# EasyEDA Pro project ProDoc_面部追踪摄像头主控板.epro, schematic Schematic2
Board Name: 面部捕捉主控板1.0; Create Date: 2026-01-11; Page Name: P1; Project Name: FAICAL TRACKER VR模块; Schematic Name: Schematic1_3; Update Date: 2026-02-02; BladeWidth: 10; Company: 嘉立创EDA; Page Size: A4; RegionStart: 1; ShowBorder: 1; TitleBlock: 1; TitleBlockPosition: 3; Version: V1.0; XRegionCount: 6; YRegionCount: 4
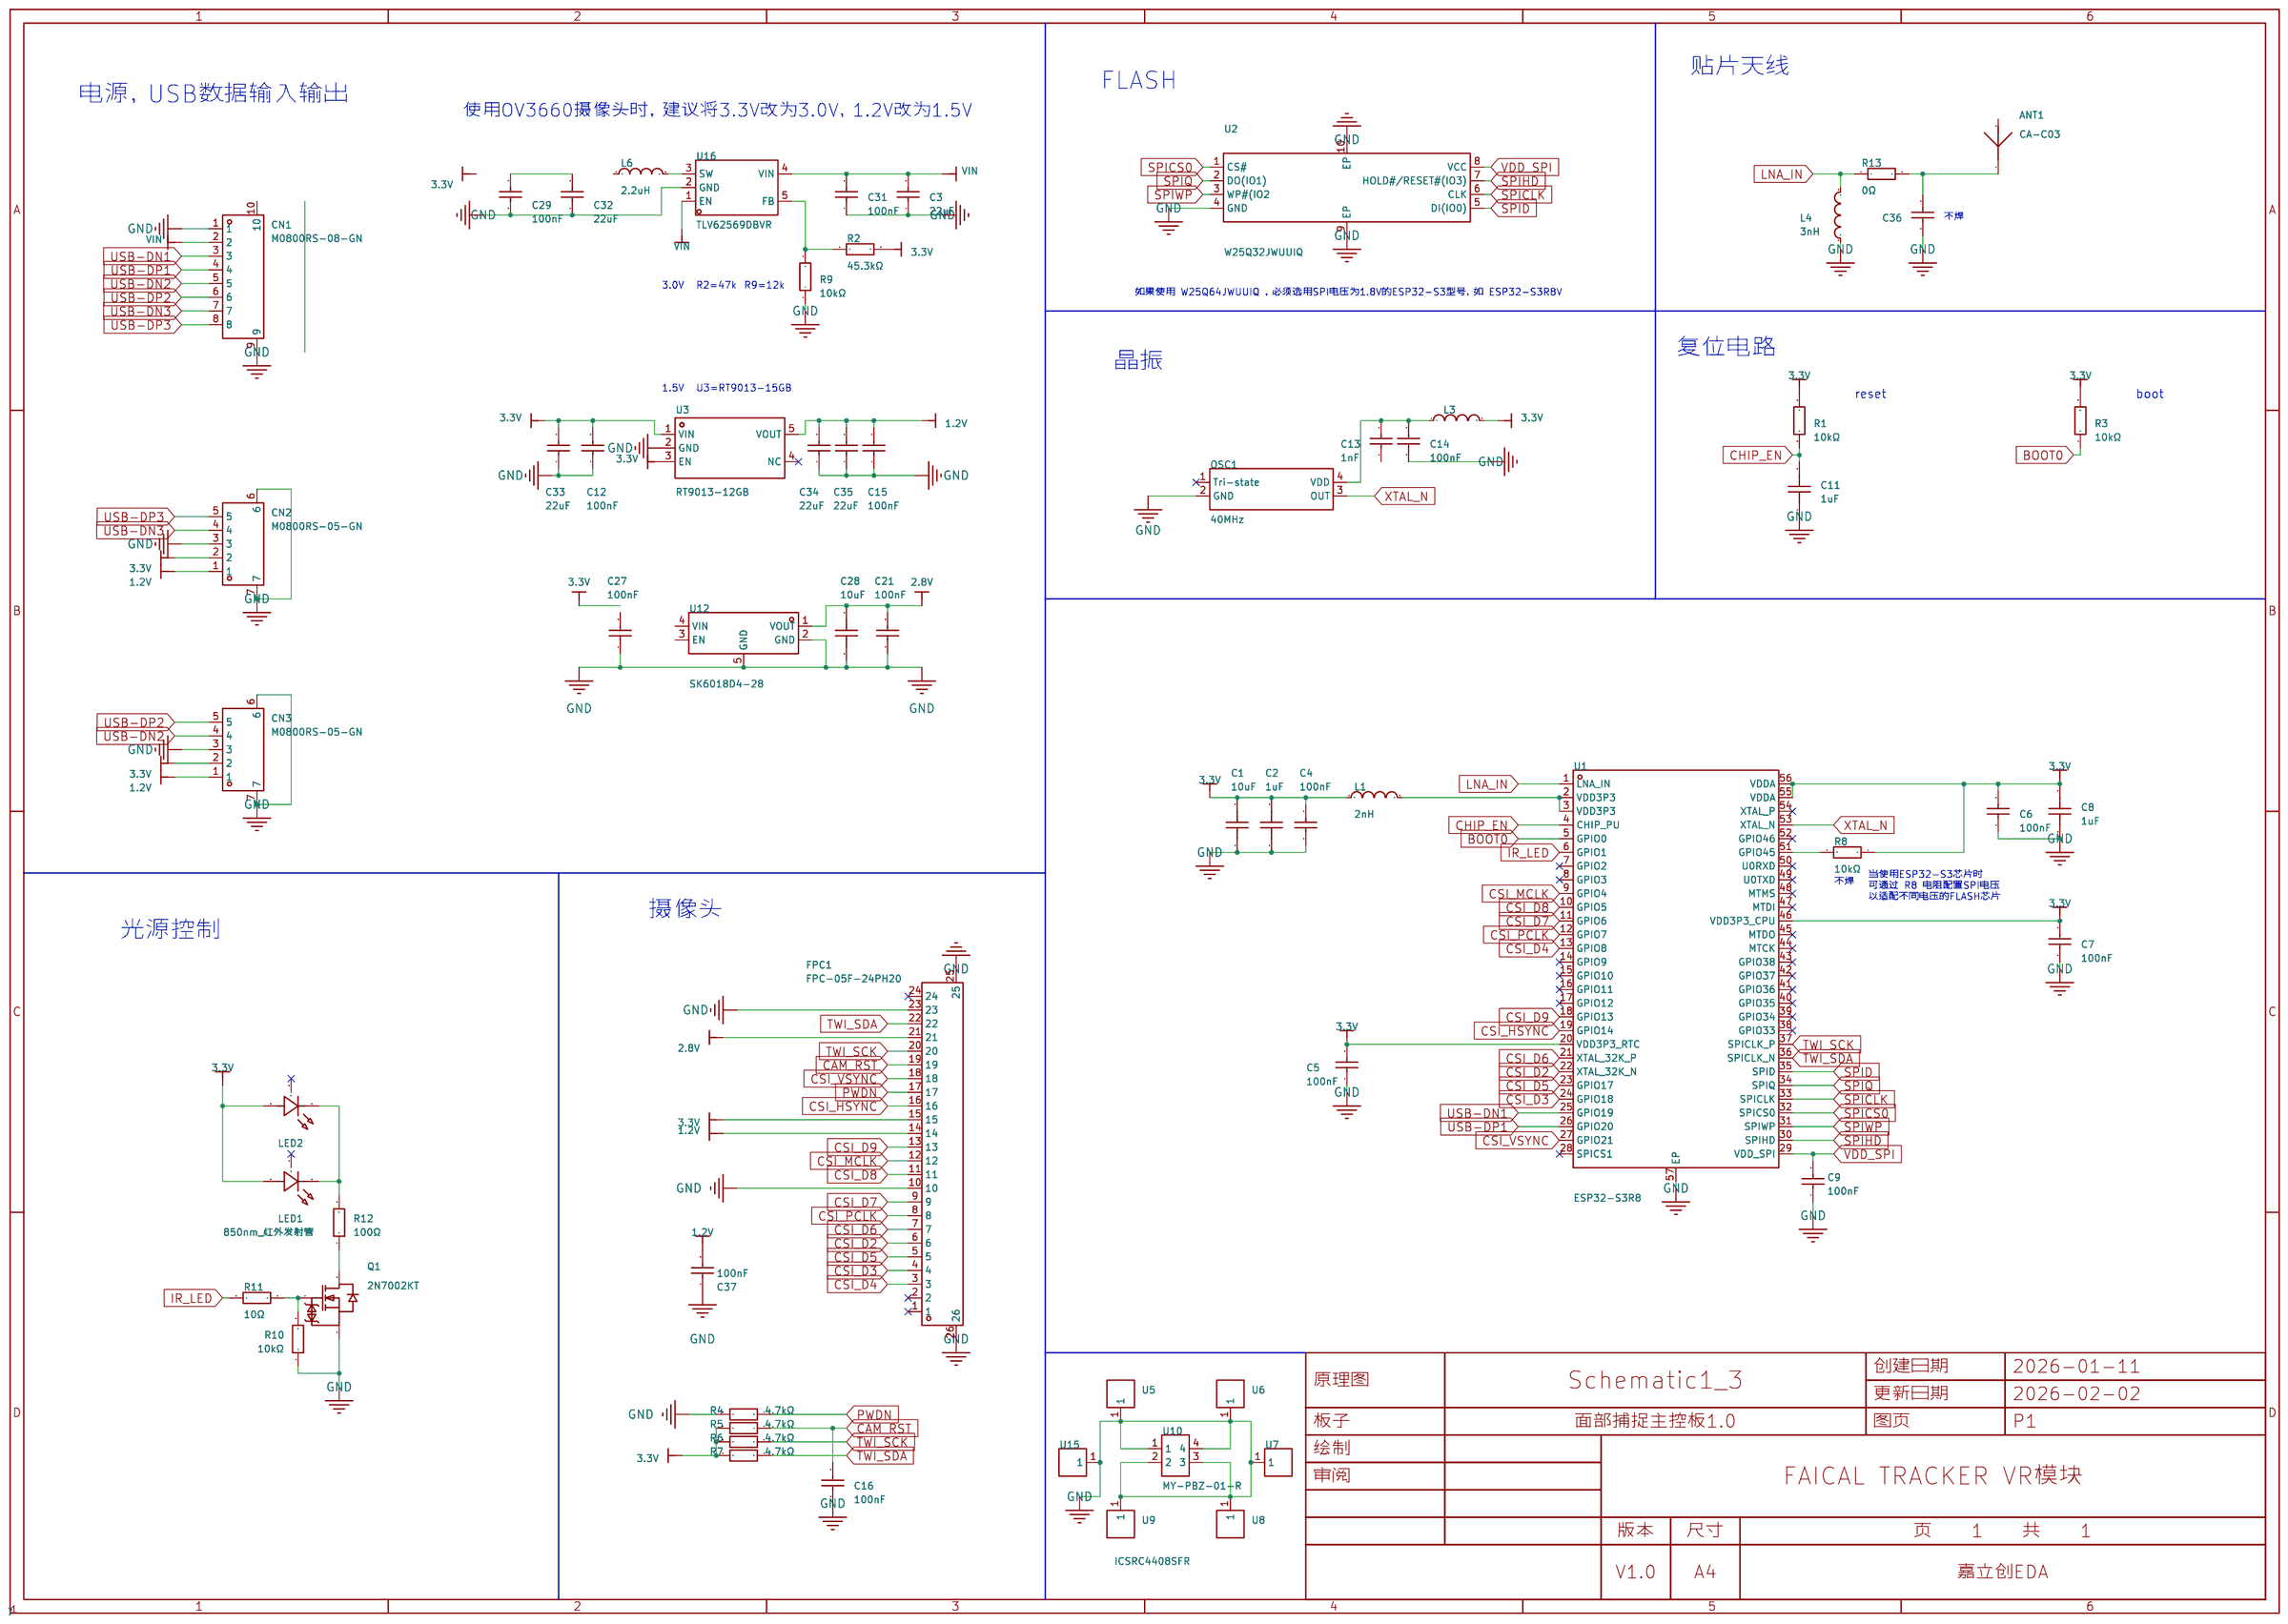
[diagram p0: schematic sheet]

## Parts
ANT1  CA-C03  [ANT-SMD_CA-C03]
C1  10uF  [0402]
C2  1uF  [0402]
C3  22uF  [0603]
C4  100nF  [0402]
C5  100nF  [0402]
C6  100nF  [0402]
C7  100nF  [0402]
C8  1uF  [0402]
C9  100nF  [0402]
C11  1uF  [0402]
C12  100nF  [0402]
C13  1nF  [0402]
C14  100nF  [0402]
C15  100nF  [0402]
C16  100nF  [0402]
C21  100nF  [0402]
C27  100nF  [0402]
C28  10uF  [0402]
C29  100nF  [0402]
C31  100nF  [0402]
C32  22uF  [0603]
C33  22uF  [0603]
C34  22uF  [0603]
C35  22uF  [0603]
C36  1pF  [0402]
C37  100nF  [0402]
CN1  M0800RS-08-GN  [CONN-SMD_M0800RS-08-GN]
CN2  M0800RS-05-GN  [CONN-SMD_M0800RS-05-GN]
CN3  M0800RS-05-GN  [CONN-SMD_M0800RS-05-GN]
FPC1  FPC-05F-24PH20  [FPC-SMD_24P-P0.50_FPC-05F-24PH20]
L1  2nH  [0402]
L3  BLM15PD121SN1D  [0402]
L4  3nH  [0402]
L6  2.2uH  [IND-SMD_L2.5-W2.0_MHCHL2520]
LED1  850nm_红外发射管  [LED-SMD_3P-L3.2-W1.5-IR]
LED2  850nm_红外发射管  [LED-SMD_3P-L3.2-W1.5-IR]
OSC1  40MHz  [OSC-SMD_4P-L2.0-W1.6-BL_S1D25.000000E10F30T]
Q1  2N7002KT  [SOT-523_L1.6-W0.8-P0.95-LS1.6-BR]
R1  10kΩ  [0402]
R2  45.3kΩ  [0402]
R3  10kΩ  [0402]
R4  4.7kΩ  [0402]
R5  4.7kΩ  [0402]
R6  4.7kΩ  [0402]
R7  4.7kΩ  [0402]
R8  10kΩ  [0402]
R9  10kΩ  [0402]
R10  10kΩ  [0402]
R11  10Ω  [0402]
R12  100Ω  [0603]
R13  0Ω  [0402]
U1  ESP32-S3R8  [QFN-56_L7.0-W7.0-P0.40-TL-EP4.0]
U2  W25Q32JWUUIQ  [USON-8_L4.0-W3.0-P0.80-BL_WINBOND_UU]
U3  RT9013-12GB  [SOT-23-5_L3.0-W1.7-P0.95-LS2.8-BR]
U5  ICSRC4408SFR  [屏蔽夹 4.4*0.8]
U6  ICSRC4408SFR  [屏蔽夹 4.4*0.8]
U7  ICSRC4408SFR  [屏蔽夹 4.4*0.8]
U8  ICSRC4408SFR  [屏蔽夹 4.4*0.8]
U9  ICSRC4408SFR  [屏蔽夹 4.4*0.8]
U10  MY-PBZ-01-R  [CONN-SMD_MY-PBZ-01-R]
U12  SK6018D4-28  [XDFN-4_L1.0-W1.0-P0.65-BL-EP]
U15  ICSRC4408SFR  [屏蔽夹 4.4*0.8]
U16  TLV62569DBVR  [SOT-23-5_L3.0-W1.7-P0.95-LS2.8-BR]

## Library data of the parts
ANT1 = CA-C03: Supplier Part: C2838842; Supplier Footprint: 5520; JLCPCB Part Class: 扩展库; Datasheet: 2021-06-05/34112A/eaa7f794ae26492fadde70fdd3fe967f/CA-C03应用手册.pdf; Supplier: LCSC
C1 C28 = CL05A106MP5NUNC: 容值:10uF;精度:±20%;额定电压:10V;材质(温度系数):X5R;; LCSC Part Name: 10uF ±20% 10V; Supplier Part: C315248; Manufacturer: SAMSUNG(三星); JLCPCB Part Class: Extended Part; Datasheet: https://atta.szlcsc.com/upload/public/pdf/source/20231220/1EF805BAE1520675928CC4638D279E74.pdf; Supplier: LCSC; Tolerance: ±20%; Voltage Rated: 10V; Temperature Coefficient: X5R
C2 C8 C11 = CL05A105KA5NQNC: 容值:1uF;精度:±10%;额定电压:25V;材质(温度系数):X5R;; LCSC Part Name: 1uF ±10% 25V; Supplier Part: C52923; Manufacturer: SAMSUNG(三星); JLCPCB Part Class: 基础库; Datasheet: https://atta.szlcsc.com/upload/public/pdf/source/20160218/1457707763339.pdf; Supplier: LCSC; Tolerance: ±10%; Voltage Rated: 25V; Temperature Coefficient: X5R
C3 C32-C35 = CL10A226MQ8NRNC: 容值:22uF;精度:±20%;额定电压:6.3V;温度系数:X5R;; LCSC Part Name: 22uF ±20% 6.3V; Supplier Part: C59461; Manufacturer: SAMSUNG(三星); JLCPCB Part Class: Basic Part; Datasheet: https://item.szlcsc.com/datasheet/CL10A226MQ8NRNC/60514.html; Supplier: LCSC; Tolerance: ±20%; Voltage Rated: 6.3V; Temperature Coefficient: X5R; Voltage Rating: 6.3V
C4-C7 C9 C16 C21 C27 = 0402B104K500NT: 容值:100nF;精度:±10%;额定电压:50V;温度系数:X7R;; LCSC Part Name: 100nF ±10% 50V; Supplier Part: C110251; Manufacturer: FH(风华); JLCPCB Part Class: 扩展库; Datasheet: https://atta.szlcsc.com/upload/public/pdf/source/20200305/C486355_26A10D38EF8C2A5C37091D0039909270.pdf; Supplier: LCSC; Tolerance: ±10%; Voltage Rating: 50V; Temperature Coefficient: X7R
C12 C14 C15 C29 C31 C37 = 0402B104K500NT: 容值:100nF;精度:±10%;额定电压:50V;温度系数:X7R;; LCSC Part Name: 100nF ±10% 50V; Supplier Part: C110251; Manufacturer: FH(风华); JLCPCB Part Class: Extended Part; Datasheet: https://atta.szlcsc.com/upload/public/pdf/source/20200305/C486355_26A10D38EF8C2A5C37091D0039909270.pdf; Supplier: LCSC; Tolerance: ±10%; Voltage Rating: 50V; Temperature Coefficient: X7R
C13 = 0402B102K500NT: 容值:1nF;精度:±10%;额定电压:50V;材质(温度系数):X7R;; LCSC Part Name: 1nF ±10% 50V; Supplier Part: C1523; Manufacturer: FH(风华); JLCPCB Part Class: Basic Part; Datasheet: https://atta.szlcsc.com/upload/public/pdf/source/20200305/C486355_26A10D38EF8C2A5C37091D0039909270.pdf; Supplier: LCSC; Tolerance: ±10%; Voltage Rated: 50V; Temperature Coefficient: X7R
C36 = GJM1555C1H1R0BB01D: 容值:1pF;额定电压:50V;温度系数:C0G;; LCSC Part Name: ±0.1pF 1pF 50V; Supplier Part: C76898; Manufacturer: muRata(村田); JLCPCB Part Class: 扩展库; Datasheet: https://item.szlcsc.com/datasheet/GJM1555C1H1R0BB01D/78025.html; Supplier: LCSC; Voltage Rating: 50V; Temperature Coefficient: C0G
CN1 = M0800RS-08-GN: 插针结构:1x8P;间距:0.8mm;安装方式:卧贴;参考系列:-;总PIN数:8P;排数:1;每排PIN数:8;行距:-;额定电流:-;工作温度范围:-;; LCSC Part Name: 1x8P 间距:0.8mm 卧贴; Supplier Part: C509170; Manufacturer: XFCN(兴飞); Supplier Footprint: SMD,P=0.8mm,卧贴; JLCPCB Part Class: Extended Part; Datasheet: https://atta.szlcsc.com/upload/public/pdf/source/20200407/C509164_BF52F945AC88792F216409D296077FAE.pdf; Supplier: LCSC; Pins Structure: 1x8P; Pitch: 0.8mm; Mounting Style: 卧贴; Number of Pins: 8P; Number of Rows: 1; Number of PINs Per Row: 8
CN2 CN3 = M0800RS-05-GN: 插针结构:1x5P;间距:0.8mm;安装方式:卧贴;参考系列:-;总PIN数:5P;排数:1;每排PIN数:5;行距:-;额定电流:-;触头材质:磷青铜;工作温度:-;; LCSC Part Name: 1x5P 间距:0.8mm 卧贴; Supplier Part: C509167; Manufacturer: XFCN(兴飞); Supplier Footprint: SMD,P=0.8mm,卧贴; JLCPCB Part Class: Extended Part; Datasheet: https://item.szlcsc.com/datasheet/M0800RS-05-GN/522976.html; Supplier: LCSC; Pins Structure: 1x5P; Pitch: 0.8mm; Mounting Type: 卧贴; Number of Pins: 5P; Number of Rows: 1; Number of PINs Per Row: 5; Contact Material: 磷青铜; Flame Retardant Rating: UL94V-0; Z-Height of the Board: 1.7mm; Y-Width of Bottom Edge on Board: 2.7mm
FPC1 = FPC-05F-24PH20: 锁定特性:翻盖式;触点类型:下接;触点数量:24P;间距:0.5mm;安装类型:卧贴;工作温度范围:-25℃~+85℃;; LCSC Part Name: 间距:0.5mm P数:24P 翻盖式 下接; Supplier Part: C2856805; Manufacturer: XUNPU(讯普); Supplier Footprint: SMD,P=0.5mm,卧贴; JLCPCB Part Class: 扩展库; Datasheet: https://atta.szlcsc.com/upload/public/pdf/source/20210922/C2856805_8542C20E2D7FF0FC4EEBD919AE0F6905.pdf; Supplier: LCSC; Locking Feature: 翻盖式; Contact Type: 下接; Number of Contacts: 24P; Pitch: 0.5mm; Mounting Type: 卧贴; FFC, FCB Thickness: 0.3mm; Height Above Board: 2mm; Operating Temperature Range: -25℃~+85℃
L1 = MLG1005S2N0BT000: 电感值:2nH;精度:-;额定电流:900mA;饱和电流(Isat):-;直流电阻(DCR):70mΩ;; LCSC Part Name: ±0.1nH 2nH; Supplier Part: C76769; Manufacturer: TDK; JLCPCB Part Class: Extended Part; Datasheet: https://atta.szlcsc.com/upload/public/pdf/source/20240116/5498F69597B6145D9954BDAE22913204.pdf; Supplier: LCSC; Current Rating: 900mA; DC Resistance(DCR): 70mΩ; Q @ Frequency: 7@100MHz; Frequency - Self Resonant: 7.5GHz
L3 = BLM15PD121SN1D: 标称阻抗@测试频率:120Ω@100MHz;误差:±25%;直流电阻(RDC):90mΩ;; LCSC Part Name: 单路 0402磁珠 阻抗120Ω@100MHz; Supplier Part: C76891; Manufacturer: muRata(村田); JLCPCB Part Class: 扩展库; Datasheet: https://atta.szlcsc.com/upload/public/pdf/source/20181120/C333978_3E581FB55966932B05020139ABDE8E01.pdf; Supplier: LCSC; Impedance @ Frequency: 120Ω@100MHz; Tolerance: ±25%; DC Resistance: 90mΩ; Current Rating: 1.3A; Circuits: 1
L4 = VHF100505HQ3N0ST: 电感值:3nH;额定电流:300mA;饱和电流(Isat):-;直流电阻(DCR):200mΩ;; LCSC Part Name: 3nH ±0.3nH; Supplier Part: C395064; Manufacturer: FH(风华); JLCPCB Part Class: Extended Part; Datasheet: https://atta.szlcsc.com/upload/public/pdf/source/20230208/097A5FD33363C9318A1C8B9447979AC6.pdf; Supplier: LCSC; Rated Current: 300mA; DC Resistance (DCR): 200mΩ
L6 = FTC252012S2R2MBCA: 电感值:2.2uH;精度:±20%;额定电流:3A;饱和电流(Isat):3.8A;类型:一体成型电感;; LCSC Part Name: 2.2uH ±20% 3.8A; Supplier Part: C5832372; Manufacturer: cjiang(长江微电); Supplier Footprint: 1008; JLCPCB Part Class: Extended Part; Datasheet: https://atta.szlcsc.com/upload/public/pdf/source/20230602/8FFEDA9C0247A92A0D4B67554BFE4091.pdf; Supplier: LCSC; Tolerance: ±20%; Rated Current: 3A; Saturation Current (Isat): 3.8A; DC Resistance (DCR): 55mΩ; Type: 一体成型电感
LED1 LED2 = 1206/1204_红外850nm: 1206/1204_红外850nm，侧面发光,红外发射管; LCSC Part Name: 贴片式发光二极管; Supplier Part: C965877; Manufacturer: XINGLIGHT(成兴光); Supplier Footprint: SMD-3P,3.2x1.5mm; JLCPCB Part Class: Extended Part; Datasheet: https://item.szlcsc.com/datasheet/XL-3210UGC/1051486.html; Supplier: LCSC; Illumination Color: 翠绿色; Wavelength - Dominant: 517.5nm~525nm; Peak Wavelength: 535nm; Lens Color: 无色透明透镜; Viewing Angle: 120°; Mounting Style: 侧贴
OSC1 = OT7EL89CJI-111YLC-40M: 频率:40MHz;常温频差:±10ppm;输出模式:CMOS;工作电压:1.8V~3.3V;频率稳定度:±20ppm;; LCSC Part Name: YSO110TR 40MHZ 4P 2016 1.8V-3.3V ±10PPM -40~85℃ (±20PPM) CMOS; Supplier Part: C7434947; Manufacturer: YXC(扬兴晶振); Supplier Footprint: SMD2016-4P; JLCPCB Part Class: Extended Part; Datasheet: https://atta.szlcsc.com/upload/public/pdf/source/20240731/596E5F7673E50DA744B7F79F139FB8DF.pdf; Supplier: LCSC; Normal temperature Frequency Tolerance: ±10ppm; Output Type: CMOS; Voltage - Supply: 1.8V~3.3V; Frequency Stability: ±20ppm; Operating Temperature: -40℃~+85℃
Q1 = 2N7002KT_C45406498: 漏源电压(Vdss):60V;连续漏极电流(Id):340mA;导通电阻(RDS(on)):3.2Ω@4.5V;耗散功率(Pd):150mW;阈值电压(Vgs(th)):2.5V@1mA;; LCSC Part Name: 60V N通道增强模式MOSFET; Supplier Part: C45406498; Manufacturer: MDD(辰达半导体); Supplier Footprint: SOT-523; JLCPCB Part Class: 扩展库; Datasheet: https://item.szlcsc.com/datasheet/2N7002KT/47507896.html; Supplier: LCSC; Drain to Source Voltage: 60V; Current - Continuous Drain(Id): 340mA; RDS(on): 3.2Ω@4.5V; Pd - Power Dissipation: 150mW; Gate Threshold Voltage (Vgs(th)): 2.5V@1mA; Input Capacitance(Ciss): 40pF; Reverse Transfer Capacitance (Crss@Vds): 10pF; Type: N沟道; Output Capacitance(Coss): 30pF
R1 R3 R8 R10 = 0402WGF1002TCE: 电阻类型:厚膜电阻;阻值:10kΩ;精度:±1%;功率:62.5mW;最大工作电压:50V;温度系数:±100ppm/℃;; LCSC Part Name: 10kΩ ±1% 62.5mW 厚膜电阻; Supplier Part: C25744; Manufacturer: UNI-ROYAL(厚声); JLCPCB Part Class: 基础库; Datasheet: https://atta.szlcsc.com/upload/public/pdf/source/20200306/C422600_1E6D84923E4A46A82E41ADD87F860B5C.pdf; Supplier: LCSC; Type: 厚膜电阻; Tolerance: ±1%; Power(Watts): 62.5mW; Overload Voltage (Max): 50V; Temperature Coefficient: ±100ppm/℃; Operating Temperature Range: -55℃~+155℃
R2 = 0402WGF4532TCE: 电阻类型:厚膜电阻;阻值:45.3kΩ;精度:±1%;功率:62.5mW;工作电压:50V;温度系数:±100ppm/℃;; LCSC Part Name: 45.3kΩ ±1% 62.5mW 厚膜电阻; Supplier Part: C26980; Manufacturer: UNI-ROYAL(厚声); JLCPCB Part Class: Extended Part; Datasheet: https://item.szlcsc.com/datasheet/0402WGF4532TCE/27729.html; Supplier: LCSC; Type: 厚膜电阻; Tolerance: ±1%; Power(Watts): 62.5mW; Overload Voltage (Max): 50V; Temperature Coefficient: ±100ppm/℃; Operating Temperature Range: -55℃~+155℃; Voltage-Supply(Max): 50V; Operating Temperature: -55℃~+155℃
R4-R7 = 0402WGF4701TCE: 电阻类型:厚膜电阻;阻值:4.7kΩ;精度:±1%;功率:62.5mW;工作电压:50V;温度系数:±100ppm/℃;; LCSC Part Name: 4.7kΩ ±1% 62.5mW 厚膜电阻; Supplier Part: C25900; Manufacturer: UNI-ROYAL(厚声); JLCPCB Part Class: Basic Part; Datasheet: https://item.szlcsc.com/datasheet/0402WGF4701TCE/26643.html; Supplier: LCSC; Type: 厚膜电阻; Tolerance: ±1%; Power(Watts): 62.5mW; Overload Voltage (Max): 50V; Temperature Coefficient: ±100ppm/℃; Operating Temperature Range: -55℃~+155℃; Voltage-Supply(Max): 50V; Operating Temperature: -55℃~+155℃
R9 = 0402WGF1002TCE: 电阻类型:厚膜电阻;阻值:10kΩ;精度:±1%;功率:62.5mW;工作电压:50V;温度系数:±100ppm/℃;; LCSC Part Name: 10kΩ ±1% 62.5mW 厚膜电阻; Supplier Part: C25744; Manufacturer: UNI-ROYAL(厚声); JLCPCB Part Class: Basic Part; Datasheet: https://item.szlcsc.com/datasheet/0402WGF1002TCE/26487.html; Supplier: LCSC; Type: 厚膜电阻; Tolerance: ±1%; Power(Watts): 62.5mW; Overload Voltage (Max): 50V; Temperature Coefficient: ±100ppm/℃; Operating Temperature Range: -55℃~+155℃; Voltage-Supply(Max): 50V; Operating Temperature: -55℃~+155℃
R11 = 0402WGF100JTCE: 电阻类型:厚膜电阻;阻值:10Ω;精度:±1%;功率:62.5mW;工作电压:50V;温度系数:±200ppm/℃;; LCSC Part Name: 10Ω ±1% 62.5mW 厚膜电阻; Supplier Part: C25077; Manufacturer: UNI-ROYAL(厚声); JLCPCB Part Class: Basic Part; Datasheet: https://item.szlcsc.com/datasheet/0402WGF100JTCE/25820.html; Supplier: LCSC; Type: 厚膜电阻; Tolerance: ±1%; Power(Watts): 62.5mW; Overload Voltage (Max): 50V; Temperature Coefficient: ±200ppm/℃; Operating Temperature Range: -55℃~+155℃; Voltage-Supply(Max): 50V; Operating Temperature: -55℃~+155℃
R12 = 0603WAF1000T5E: 电阻类型:厚膜电阻;阻值:100Ω;精度:±1%;功率:100mW;最大工作电压:75V;温度系数:±200ppm/℃;; LCSC Part Name: 100Ω ±1% 100mW 厚膜电阻; Supplier Part: C22775; Manufacturer: UNI-ROYAL(厚声); JLCPCB Part Class: 基础库; Datasheet: https://atta.szlcsc.com/upload/public/pdf/source/20200306/C422600_1E6D84923E4A46A82E41ADD87F860B5C.pdf; Supplier: LCSC; Type: 厚膜电阻; Tolerance: ±1%; Power(Watts): 100mW; Overload Voltage (Max): 75V; Temperature Coefficient: ±200ppm/℃; Operating Temperature Range: -55℃~+155℃
R13 = 0402WGF0000TCE: 电阻类型:厚膜电阻;阻值:0Ω;精度:±1%;功率:62.5mW;工作电压:50V;温度系数:±800ppm/℃;; LCSC Part Name: 0Ω ±1% 62.5mW 厚膜电阻; Supplier Part: C17168; Manufacturer: UNI-ROYAL(厚声); JLCPCB Part Class: Basic Part; Datasheet: https://item.szlcsc.com/datasheet/0402WGF0000TCE/17853.html; Supplier: LCSC; Type: 厚膜电阻; Tolerance: ±1%; Power(Watts): 62.5mW; Voltage-Supply(Max): 50V; Temperature Coefficient: ±800ppm/℃; Operating Temperature: -55℃~+155℃
U1 = ESP32-S3R8: 频率范围:2.412GHz~2.484GHz;接口类型:I2C；I2S；UART；USB；SPI;应用领域:蓝牙；IoT；WiFi;数据速率:150Mbps;灵敏度:-74.2dBm;典型应用频率:2.4GHz;; Supplier Part: C2913194; Manufacturer: ESPRESSIF(乐鑫); Supplier Footprint: QFN-56(7x7); JLCPCB Part Class: Extended Part; Datasheet: https://item.szlcsc.com/datasheet/ESP32-S3R8/3198292.html; Supplier: LCSC; Frequency Range: 2.412GHz~2.484GHz; Interface: I2C；I2S；UART；USB；SPI; Voltage - Supply: 3V~3.6V; Applications: 蓝牙；IoT；WiFi; Output Power: 18.5dBm; Data Rate: 150Mbps; Current Of Transmitting: 283mA; Sensitivity: -74.2dBm; Receive Current: 88mA; Typical Application Frequency: 2.4GHz; Operating Temperature: -40℃~+65℃
U2 = W25Q32JWUUIQ: 接口类型:SPI;存储容量:32Mbit;时钟频率(fc):133MHz;; LCSC Part Name: 支持双路、四路SPI接口的1.8V、32Mbit 串行闪存; Supplier Part: C2760370; Manufacturer: Winbond(华邦); Supplier Footprint: USON-8(3x4); JLCPCB Part Class: Extended Part; Datasheet: https://item.szlcsc.com/datasheet/W25Q32JWUUIQ/2881016.html; Supplier: LCSC; Interface: SPI; Memory Size: 32Mbit; Clock Frequency: 133MHz; Voltage - Supply: 1.7V~1.95V; Program / Erase Cycles: 100000次; Page Programming Time (Tpp): 800us; Block Erase Time(tBE): 120ms@(32KB); Data Retention - TDR (Year): 20年
U3 = RT9013-12GB: 输出类型:固定;最大输入电压:5.5V;输出电压:1.2V;最大输出电流:500mA;电源纹波抑制比(PSRR):50dB@(10kHz);输出极性:正极;; LCSC Part Name: 输入5.5V 输出1.2V~1.2V 500mA; Supplier Part: C58464; Manufacturer: RICHTEK(立锜); Supplier Footprint: SOT-23-5; JLCPCB Part Class: 扩展库; Datasheet: https://atta.szlcsc.com/upload/public/pdf/source/20151126/1457707591671.pdf; Supplier: LCSC; Output Type: 固定; Maximum Input Voltage: 5.5V; Output Voltage: 1.2V; MAX Output Current: 500mA; Power Supply Rejection Ratio (PSRR): 50dB@(10kHz); Dropout Voltage: 400mV@(500mA); standby current: 50uA; Operating Temperature: -40℃~+85℃; Output Polarity: 正极; Number of Outputs: 1
U5-U9 U15 = ICSRC4408SFR: LCSC Part Name: ICT，屏蔽夹 ，长4.4mm*高0.8mm，ICSRC4408SFR; Supplier Part: C238201; Manufacturer: ICT; JLCPCB Part Class: Extended Part; Datasheet: https://item.szlcsc.com/datasheet/ICSRC4408SFR/237762.html; Supplier: LCSC; size: 4.4mm*0.8mm; colour: 白色
U10 = MY-PBZ-01-R: 屏蔽罩PBZ屏蔽框/屏蔽架/屏蔽盖/阻止产品内部电路和生产的电磁波向外辐射，防尘，材质：洋白铜; LCSC Part Name: 屏蔽罩; Supplier Part: C964879; Manufacturer: MYOUNG(美阳); Supplier Footprint: DIP; JLCPCB Part Class: 扩展库; Datasheet: https://item.szlcsc.com/datasheet/MY-PBZ-01-R/1049845.html; Supplier: LCSC; material quality: 洋白铜; characteristic: 阻止产品内部电路和生产的电磁波向外辐射,防尘; size: 13.84*10.47mm
U12 = SK6018D4-28: 输出类型:固定;工作电压:6.5V;输出电压:2.8V;输出电流:300mA;电源纹波抑制比(PSRR):-;输出极性:正极;; LCSC Part Name: 低压差线性稳压器; Supplier Part: C2682757; Manufacturer: suntek(洺太电子); Supplier Footprint: XDFN-4-EP(1x1); JLCPCB Part Class: Extended Part; Datasheet: https://item.szlcsc.com/datasheet/SK6018D4-28/2777833.html; Supplier: LCSC; Output Type: 固定; Voltage - Supply: 6.5V; Output Voltage: 2.8V; Output Current: 300mA; standby current: 1uA; Features: 带使能; Operating Temperature: -40℃~+85℃@(Ta); Output Configuration: 正极; Number of Outputs: 1
U16 = TLV62569DBVR: 功能类型:降压型;工作电压:2.5V~5.5V;输出电压:600mV~5.5V;输出电流:2A;输出类型:可调;; LCSC Part Name: 高效率同步降压转换器; Supplier Part: C141836; Manufacturer: TI(德州仪器); Supplier Footprint: SOT-23-5; JLCPCB Part Class: 扩展库; Datasheet: https://www.ti.com/cn/lit/gpn/tlv62569; Supplier: LCSC; Function: 降压型; Voltage - Supply: 2.5V~5.5V; Output Voltage: 600mV~5.5V; Output Current: 2A; Frequency - Switching: 1.5MHz; Operating Temperature: -40℃~+125℃@(TJ); Synchronous Rectifier: 是; Number of Outputs: 1; Topology: 降压式; Switch tube (built-in/external): 内置; Output Type: 可调

## Nets
1.2V: C15.2 C34.2 C35.2 C37.2 CN2.1 CN3.1 FPC1.15 U3.5(VOUT)
2.8V: C21.2 C28.2 FPC1.21 U12.1(VOUT)
3.3V: C1.2 C2.2 C4.2 C5.2 C6.2 C7.2 C8.2 C12.2 C27.2 C29.1 C32.1 C33.2 CN2.2 CN3.2 FPC1.14 L1.1 L3.2 L6.1 LED1.2 LED2.2 R1.2 R2.2 R3.2 R5.2 R6.2 R7.2 R8.1 U1.20(VDD3P3_RTC) U1.46(VDD3P3_CPU) U1.55(VDDA) U1.56(VDDA) U3.1(VIN) U3.3(EN) U12.3(EN) U12.4(VIN)
GND: C1.1 C2.1 C3.1 C4.1 C5.1 C6.1 C7.1 C8.1 C9.1 C11.1 C12.1 C13.1 C14.1 C15.1 C16.1 C21.1 C27.1 C28.1 C29.2 C31.1 C32.2 C33.1 C34.1 C35.1 C36.1 C37.1 CN1.1 CN1.9 CN1.10 CN2.3 CN2.6 CN2.7 CN3.3 CN3.6 CN3.7 FPC1.10 FPC1.23 FPC1.25 FPC1.26 L4.1 OSC1.2(GND) Q1.2(S) R4.2 R9.1 R10.1 U1.57(EP) U2.4(GND) U2.9(EP) U2.10(EP) U3.2(GND) U5.1 U6.1 U7.1 U8.1 U9.1 U10.1 U10.2 U10.3 U10.4 U12.2(GND) U12.5(GND) U15.1 U16.2(GND)
VDD_SPI: C9.2 U1.29(VDD_SPI) U2.8(VCC)
VIN: C3.2 C31.2 CN1.2 U16.1(EN) U16.4(VIN)
BOOT0: R3.1 U1.5(GPIO0)
CAM_RST: C16.2 FPC1.19 R5.1
CHIP_EN: C11.2 R1.1 U1.4(CHIP_PU)
CSI_D2: FPC1.6 U1.22(XTAL_32K_N)
CSI_D3: FPC1.4 U1.24(GPIO18)
CSI_D4: FPC1.3 U1.13(GPIO8)
CSI_D5: FPC1.5 U1.23(GPIO17)
CSI_D6: FPC1.7 U1.21(XTAL_32K_P)
CSI_D7: FPC1.9 U1.11(GPIO6)
CSI_D8: FPC1.11 U1.10(GPIO5)
CSI_D9: FPC1.13 U1.18(GPIO13)
CSI_HSYNC: FPC1.16 U1.19(GPIO14)
CSI_MCLK: FPC1.12 U1.9(GPIO4)
CSI_PCLK: FPC1.8 U1.12(GPIO7)
CSI_VSYNC: FPC1.18 U1.27(GPIO21)
IR_LED: R11.2 U1.6(GPIO1)
LNA_IN: L4.2 R13.1 U1.1(LNA_IN)
PWDN: FPC1.17 R4.1
SPICLK: U1.33(SPICLK) U2.6(CLK)
SPICS0: U1.32(SPICS0) U2.1(CS#)
SPID: U1.35(SPID) U2.5(DI(IO0))
SPIHD: U1.30(SPIHD) U2.7(HOLD#/RESET#(IO3))
SPIQ: U1.34(SPIQ) U2.2(DO(IO1))
SPIWP: U1.31(SPIWP) U2.3(WP#(IO2)
TWI_SCK: FPC1.20 R6.1 U1.37(SPICLK_P)
TWI_SDA: FPC1.22 R7.1 U1.36(SPICLK_N)
USB-DN1: CN1.3 U1.25(GPIO19)
USB-DN2: CN1.5 CN3.4
USB-DN3: CN1.7 CN2.4
USB-DP1: CN1.4 U1.26(GPIO20)
USB-DP2: CN1.6 CN3.5
USB-DP3: CN1.8 CN2.5
XTAL_N: OSC1.3(OUT) U1.53(XTAL_N)
$1N1778: L1.2 U1.2(VDD3P3) U1.3(VDD3P3)
$1N20382: C13.2 C14.2 L3.1 OSC1.4(VDD)
$1N20736: ANT1.1(ANT) C36.2 R13.2
$1N28125: R8.2 U1.51(GPIO45)
$1N40253: R2.1 R9.2 U16.5(FB)
$1N40257: L6.2 U16.3(SW)
$1N41252: Q1.1(G) R10.2 R11.1
$1N41612: LED1.1 LED2.1 R12.2
$1N41730: Q1.3(D) R12.1

Not connected (* = marked no-connect by the designer): ANT1 2(NC); FPC1 1* 2* 24*; LED1 3*; LED2 3*; OSC1 1(Tri-state)*; U1 7(GPIO2)* 8(GPIO3)* 14(GPIO9)* 15(GPIO10)* 16(GPIO11)* 17(GPIO12)* 28(SPICS1)* 38(GPIO33)* 39(GPIO34)* 40(GPIO35)* 41(GPIO36)* 42(GPIO37)* 43(GPIO38)* 44(MTCK)* 45(MTDO)* 47(MTDI)* 48(MTMS)* 49(U0TXD)* 50(U0RXD)* 52(GPIO46)* 54(XTAL_P)*; U3 4(NC)*

## Notes on the sheet
- 贴片天线
- FLASH
- 电源，USB数据输入输出
- 使用OV3660摄像头时，建议将3.3V改为3.0V，1.2V改为1.5V
- 不焊
- 3.0V
- R2=47k
- R9=12k
- 如果使用 W25Q64JWUUIQ ，必须选用SPI电压为1.8V的ESP32-S3型号，如 ESP32-S3R8V
- 晶振
- 复位电路
- 1.5V
- U3=RT9013-15GB
- reset
- boot
- 当使用ESP32-S3芯片时
  可通过 R8 电阻配置SPI电压
  以适配不同电压的FLASH芯片
- 不焊
- 摄像头
- 光源控制
